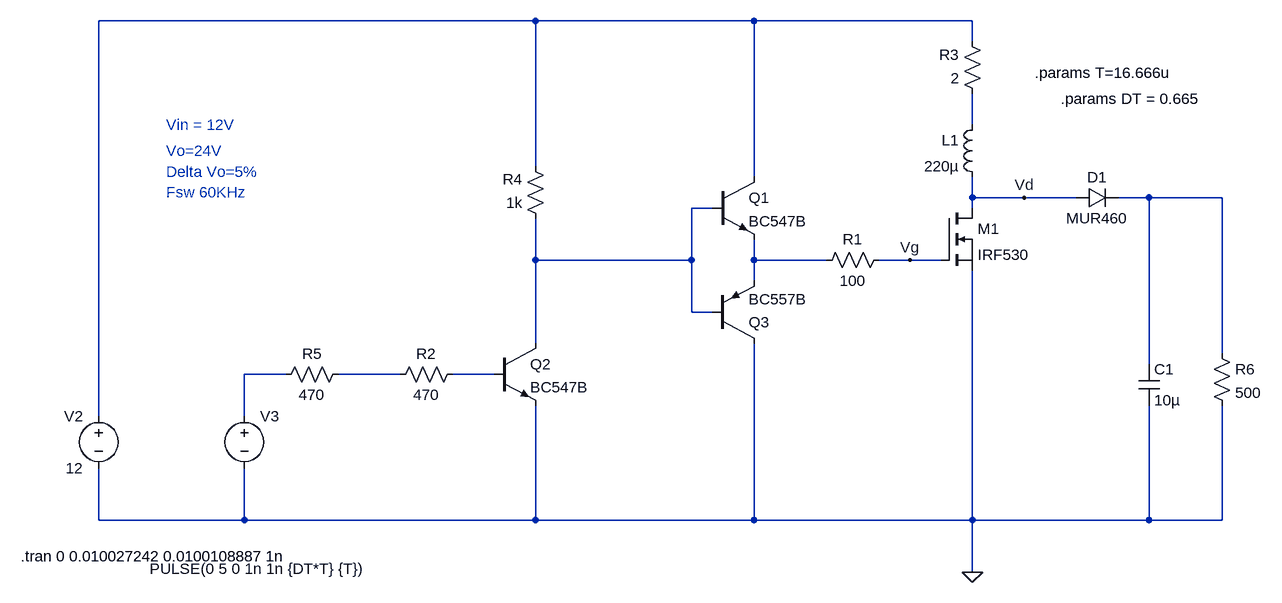
[diagram p0: schematic Draft4.asc]
Draft4.asc, the LTspice schematic file:
Version 4
SHEET 1 1280 680
WIRE -80 -272 -752 -272
WIRE 256 -272 -80 -272
WIRE 592 -272 256 -272
WIRE 592 -240 592 -272
WIRE 592 -112 592 -160
WIRE -80 -48 -80 -272
WIRE 256 -32 256 -272
WIRE 592 0 592 -32
WIRE 672 0 592 0
WIRE 752 0 672 0
WIRE 864 0 816 0
WIRE 976 0 864 0
WIRE 192 16 160 16
WIRE 592 16 592 0
WIRE -80 96 -80 32
WIRE 160 96 160 16
WIRE 160 96 -80 96
WIRE 256 96 256 64
WIRE 368 96 256 96
WIRE 496 96 448 96
WIRE 544 96 496 96
WIRE 256 128 256 96
WIRE 160 176 160 96
WIRE 192 176 160 176
WIRE -80 224 -80 96
WIRE 976 240 976 0
WIRE 864 256 864 0
WIRE -464 272 -528 272
WIRE -288 272 -384 272
WIRE -144 272 -208 272
WIRE -752 336 -752 -272
WIRE -528 336 -528 272
WIRE -752 496 -752 416
WIRE -528 496 -528 416
WIRE -528 496 -752 496
WIRE -80 496 -80 320
WIRE -80 496 -528 496
WIRE 256 496 256 224
WIRE 256 496 -80 496
WIRE 592 496 592 112
WIRE 592 496 256 496
WIRE 864 496 864 320
WIRE 864 496 592 496
WIRE 976 496 976 320
WIRE 976 496 864 496
WIRE 592 576 592 496
FLAG 592 576 0
FLAG 496 96 Vg
FLAG 672 0 Vd
SYMBOL npn 192 -32 R0
SYMATTR InstName Q1
SYMATTR Value BC547B
SYMBOL npn -144 224 R0
SYMATTR InstName Q2
SYMATTR Value BC547B
SYMBOL pnp 192 224 M180
SYMATTR InstName Q3
SYMATTR Value BC557B
SYMBOL nmos 544 16 R0
SYMATTR InstName M1
SYMATTR Value IRF530
SYMBOL diode 752 16 R270
WINDOW 0 32 32 VTop 2
WINDOW 3 0 32 VBottom 2
SYMATTR InstName D1
SYMATTR Value MUR460
SYMBOL res 464 80 R90
WINDOW 0 0 56 VBottom 2
WINDOW 3 32 56 VTop 2
SYMATTR InstName R1
SYMATTR Value 100
SYMBOL res -192 256 R90
WINDOW 0 0 56 VBottom 2
WINDOW 3 32 56 VTop 2
SYMATTR InstName R2
SYMATTR Value 470
SYMBOL res 608 -144 R180
WINDOW 0 36 76 Left 2
WINDOW 3 36 40 Left 2
SYMATTR InstName R3
SYMATTR Value 2
SYMBOL res -64 48 R180
WINDOW 0 36 76 Left 2
WINDOW 3 36 40 Left 2
SYMATTR InstName R4
SYMATTR Value 1k
SYMBOL res -480 288 R270
WINDOW 0 32 56 VTop 2
WINDOW 3 0 56 VBottom 2
SYMATTR InstName R5
SYMATTR Value 470
SYMBOL ind 608 -128 M0
SYMATTR InstName L1
SYMATTR Value 220µ
SYMBOL voltage -752 320 M0
WINDOW 123 0 0 Left 0
WINDOW 39 0 0 Left 0
SYMATTR InstName V2
SYMATTR Value 12
SYMBOL cap 848 256 R0
SYMATTR InstName C1
SYMATTR Value 10µ
SYMBOL res 960 224 R0
SYMATTR InstName R6
SYMATTR Value 500
SYMBOL voltage -528 320 R0
WINDOW 3 -146 251 Left 2
WINDOW 123 0 0 Left 0
WINDOW 39 0 0 Left 0
SYMATTR Value PULSE(0 5 0 1n 1n {DT*T} {T})
SYMATTR InstName V3
TEXT -872 552 Left 2 !.tran 0 0.010027242 0.0100108887 1n
TEXT -648 -112 Left 2 ;Vin = 12V
TEXT -648 -72 Left 2 ;Vo=24V
TEXT -648 -40 Left 2 ;Delta Vo=5%
TEXT -648 -8 Left 2 ;Fsw 60KHz
TEXT 728 -152 Left 2 !.params DT = 0.665
TEXT 688 -192 Left 2 !.params T=16.666u

The netlist it stands for:
* Draft4.asc
Q1 N001 N004 N005 0 BC547B
Q2 N004 N008 0 0 BC547B
Q3 0 N004 N005 0 BC557B
M1 Vd Vg 0 0 IRF530
D1 Vd N003 MUR460
R1 Vg N005 100
R2 N008 N007 470
R3 N002 N001 2
R4 N004 N001 1k
R5 N006 N007 470
L1 N002 Vd 220µ
V2 N001 0 12
C1 N003 0 10µ
R6 N003 0 500
V3 N006 0 PULSE(0 5 0 1n 1n {DT*T} {T})
.model D D
.lib standard.dio
.model NPN NPN
.model PNP PNP
.lib standard.bjt
.model NMOS NMOS
.model PMOS PMOS
.lib standard.mos
.tran 0 0.010027242 0.0100108887 1n
* Vin = 12V
* Vo=24V
* Delta Vo=5%
* Fsw 60KHz
.params DT = 0.665
.params T=16.666u
.backanno
.end